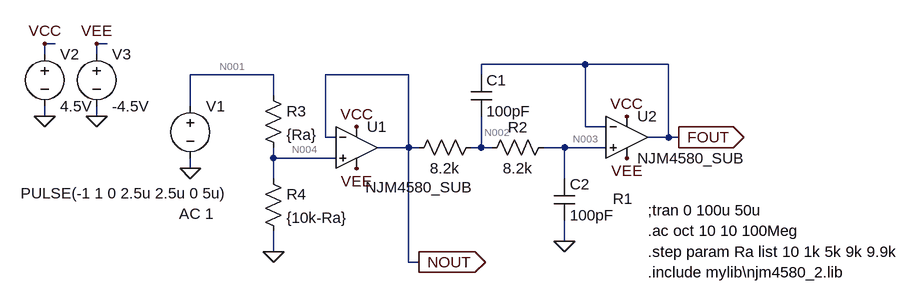
[diagram p0: schematic NJM4580 2nd VCVS with POT Buffer.asc]
NJM4580 2nd VCVS with POT Buffer.asc, the LTspice schematic file:
Version 4
SHEET 1 1100 680
WIRE -576 -64 -592 -64
WIRE -496 -64 -512 -64
WIRE -592 -48 -592 -64
WIRE -512 -48 -512 -64
WIRE 240 -32 80 -32
WIRE 368 -32 240 -32
WIRE -240 -16 -368 -16
WIRE -32 -16 -160 -16
WIRE 80 -16 80 -32
WIRE -240 16 -240 -16
WIRE -368 32 -368 -16
WIRE -592 48 -592 32
WIRE -512 48 -512 32
WIRE 240 64 240 -32
WIRE 272 64 240 64
WIRE -160 80 -160 -16
WIRE -144 80 -160 80
WIRE 368 80 368 -32
WIRE 368 80 336 80
WIRE 384 80 368 80
WIRE -32 96 -32 -16
WIRE -32 96 -80 96
WIRE -16 96 -32 96
WIRE 80 96 80 48
WIRE 80 96 64 96
WIRE 96 96 80 96
WIRE 208 96 176 96
WIRE 272 96 208 96
WIRE -240 112 -240 96
WIRE -144 112 -240 112
WIRE -368 128 -368 112
WIRE -240 144 -240 112
WIRE 208 144 208 96
WIRE 208 240 208 208
WIRE -240 256 -240 224
WIRE -32 272 -32 96
WIRE -16 272 -32 272
FLAG -368 128 0
FLAG 208 240 0
FLAG -592 48 0
FLAG -512 48 0
FLAG -592 -64 VCC
FLAG -512 -64 VEE
FLAG 304 48 VCC
FLAG 304 112 VEE
FLAG 384 80 FOUT
IOPIN 384 80 Out
FLAG -240 256 0
FLAG -112 64 VCC
FLAG -112 128 VEE
FLAG -16 272 NOUT
IOPIN -16 272 Out
SYMBOL res 80 80 R90
WINDOW 0 110 -218 VBottom 2
WINDOW 3 32 56 VTop 2
SYMATTR InstName R1
SYMATTR Value 8.2k
SYMBOL res 192 80 R90
WINDOW 0 0 56 VBottom 2
WINDOW 3 32 56 VTop 2
SYMATTR InstName R2
SYMATTR Value 8.2k
SYMBOL cap 64 -16 R0
SYMATTR InstName C1
SYMATTR Value 100pF
SYMBOL cap 192 144 R0
SYMATTR InstName C2
SYMATTR Value 100pF
SYMBOL voltage -368 16 R0
WINDOW 123 -17 182 Left 2
WINDOW 39 0 0 Left 2
WINDOW 3 -261 150 Left 2
SYMATTR Value2 AC 1
SYMATTR Value PULSE(-1 1 0 2.5u 2.5u 0 5u)
SYMATTR InstName V1
SYMBOL voltage -592 -64 R0
WINDOW 123 0 0 Left 2
WINDOW 39 0 0 Left 2
SYMATTR InstName V2
SYMATTR Value 4.5V
SYMBOL voltage -512 -64 R0
WINDOW 123 0 0 Left 2
WINDOW 39 0 0 Left 2
SYMATTR InstName V3
SYMATTR Value -4.5V
SYMBOL res -256 0 R0
SYMATTR InstName R3
SYMATTR Value {Ra}
SYMBOL res -256 128 R0
SYMATTR InstName R4
SYMATTR Value {10k-Ra}
SYMBOL Opamps\\opamp2 -112 32 R0
WINDOW 3 14 125 Left 2
SYMATTR Value NJM4580_SUB
SYMATTR InstName U1
SYMBOL Opamps\\opamp2 304 16 R0
SYMATTR InstName U2
SYMATTR Value NJM4580_SUB
TEXT 336 192 Left 2 !;tran 0 100u 50u
TEXT 336 224 Left 2 !.ac oct 10 10 100Meg
TEXT 336 256 Left 2 !.step param Ra list 10 1k 5k 9k 9.9k
TEXT 336 288 Left 2 !.include mylib\\njm4580_2.lib

The netlist it stands for:
* NJM4580 2nd VCVS with POT Buffer.asc
R1 N002 NOUT 8.2k
R2 N003 N002 8.2k
C1 FOUT N002 100pF
C2 N003 0 100pF
V1 N001 0 PULSE(-1 1 0 2.5u 2.5u 0 5u) AC 1
V2 VCC 0 4.5V
V3 VEE 0 -4.5V
R3 N001 N004 {Ra}
R4 N004 0 {10k-Ra}
XU1 N004 NOUT VCC VEE NOUT NJM4580_SUB  ; pins In+ In- V+ V- OUT
XU2 N003 FOUT VCC VEE FOUT NJM4580_SUB  ; pins In+ In- V+ V- OUT
;tran 0 100u 50u
.ac oct 10 10 100Meg
.step param Ra list 10 1k 5k 9k 9.9k
.include mylib\njm4580_2.lib
.backanno
.end

* Results of the author's LTspice run, read from the files saved beside the schematic
* Operating Point (first step), zero values left out:
*   ra = 10 
*   V(n002) = -1.001 V
*   V(nout) = -1.002 V
*   V(n003) = -1 V
*   V(fout) = -1.003 V
*   V(n001) = -1 V
*   V(vcc) = 4.5 V
*   V(vee) = -4.5 V
*   V(n004) = -999 mV
*   I(R4) = -100 µA
*   I(R3) = -100.1 µA
*   I(R2) = 91.41 nA
*   I(R1) = 91.41 nA
*   I(V3) = 16.21 mA
*   I(V2) = -16.21 mA
*   I(V1) = 100.1 µA
*   Ix(u1:1) = -91.41 nA
*   Ix(u1:2) = -108.9 nA
*   Ix(u1:3) = 8.105 mA
*   Ix(u1:4) = -8.105 mA
*   Ix(u1:5) = 200.3 nA
*   Ix(u2:1) = -91.41 nA
*   Ix(u2:2) = -108.9 nA
*   Ix(u2:3) = 8.105 mA
*   Ix(u2:4) = -8.105 mA
*   Ix(u2:5) = 108.9 nA
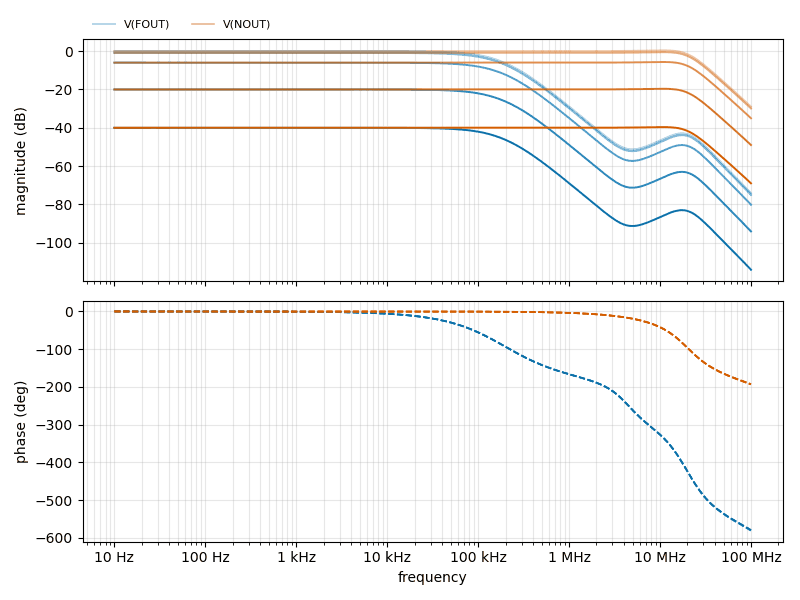
[diagram p1: AC Analysis of NJM4580 2nd VCVS with POT Buffer.asc, plotted from the saved traces]
* AC Analysis, 5 runs:
*   V(FOUT) [run 1]: -0.01 dB at 10 Hz, -74.16 dB at 100 MHz, peak -0.01 dB at 10 Hz, 3 dB below the peak at 125.2 kHz
*   V(FOUT) [run 2]: -0.92 dB at 10 Hz, -75.05 dB at 100 MHz, peak -0.92 dB at 10 Hz, 3 dB below the peak at 125.2 kHz
*   V(FOUT) [run 3]: -6.02 dB at 10 Hz, -80.12 dB at 100 MHz, peak -6.02 dB at 10 Hz, 3 dB below the peak at 125.2 kHz
*   V(FOUT) [run 4]: -20.00 dB at 10 Hz, -94.06 dB at 100 MHz, peak -20.00 dB at 10 Hz, 3 dB below the peak at 125.2 kHz
*   V(FOUT) [run 5]: -40.00 dB at 10 Hz, -114.05 dB at 100 MHz, peak -40.00 dB at 10 Hz, 3 dB below the peak at 125.2 kHz
*   V(NOUT) [run 1]: -0.01 dB at 10 Hz, -29.01 dB at 100 MHz, peak 0.38 dB at 10.49 MHz, 3 dB below the peak at 22.17 MHz
*   V(NOUT) [run 2]: -0.92 dB at 10 Hz, -29.92 dB at 100 MHz, peak -0.54 dB at 10.49 MHz, 3 dB below the peak at 22.14 MHz
*   V(NOUT) [run 3]: -6.02 dB at 10 Hz, -35.02 dB at 100 MHz, peak -5.66 dB at 10.49 MHz, 3 dB below the peak at 22.05 MHz
*   V(NOUT) [run 4]: -20.00 dB at 10 Hz, -48.98 dB at 100 MHz, peak -19.64 dB at 10.49 MHz, 3 dB below the peak at 22.06 MHz
*   V(NOUT) [run 5]: -40.00 dB at 10 Hz, -68.97 dB at 100 MHz, peak -39.64 dB at 10.49 MHz, 3 dB below the peak at 22.07 MHz